# EAGLE design aaXBee (EAGLE 6.4)
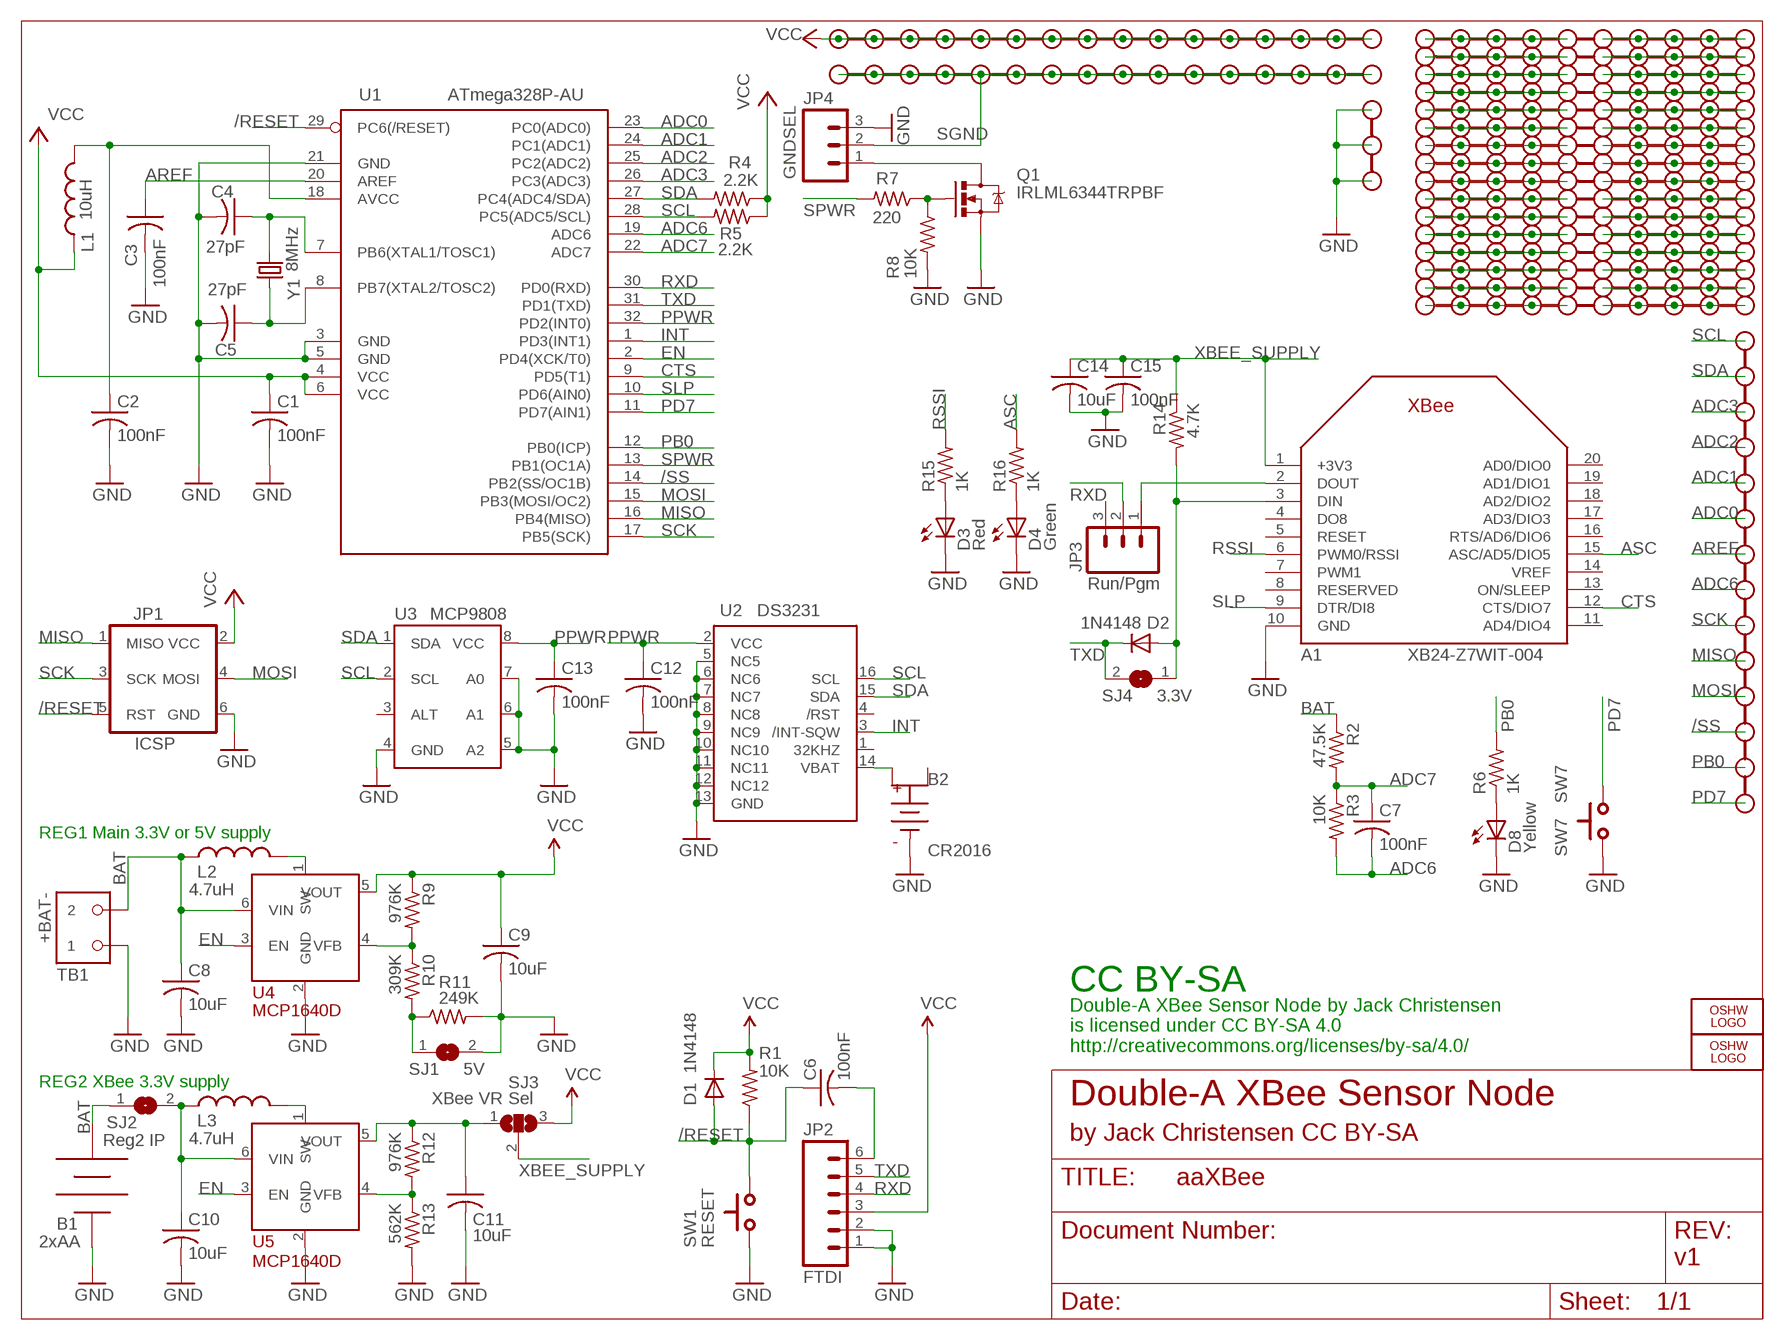
[diagram p0: schematic, sheet 1]

## Parts
A1  XB24-Z7WIT-004  ULINK_XBEEOVALPADS  [XBEE_OVAL_PADS]
B1  2xAA  BATTERY-2AANOHOLES  [KEYSTONE-2462-NO-HOLES]
B2  CR2016  COIN-CELL-2016-SMT  [BAT-HLD-002-SMT]
C1  100nF  C-USM0805  [M0805]
C2  100nF  C-USM0805  [M0805]
C3  100nF  C-USM0805  [M0805]
C4  27pF  C-USM0805  [M0805]
C5  27pF  C-USM0805  [M0805]
C6  100nF  C-USM0805  [M0805]
C7  100nF  C-USM0805  [M0805]
C8  10uF  C-USM0805  [M0805]
C9  10uF  C-USM0805  [M0805]
C10  10uF  C-USM0805  [M0805]
C11  10uF  C-USM0805  [M0805]
C12  100nF  C-USM0805  [M0805]
C13  100nF  C-USM0805  [M0805]
C14  10uF  C-USM0805  [M0805]
C15  100nF  C-USM0805  [M0805]
D1  1N4148  DIODESOD-323F-A  [SOD-323F-A]
D2  1N4148  DIODESOD-323F-A  [SOD-323F-A]
D3  Red  LEDD0805A  [D0805A]
D4  Green  LEDD0805  [D0805]
D8  Yellow  LEDD0805A  [D0805A]
JP1  ICSP  AVR_SPI_PRG_62X3_LOCK  [2X3_LOCK]
JP2  FTDI  M06LOCK  [1X06_LOCK]
JP3  Run/Pgm  M03LOCK  [1X03_LOCK]
JP4  GNDSEL  M03LOCK  [1X03_LOCK]
L1  10uH  INDUCTORM0805  [M0805]
L2  4.7uH  INDUCTORNRS4018  [NRS4018]
L3  4.7uH  INDUCTORNRS4018  [NRS4018]
LOGO1  OSHW_LOGO_8MILX0150-NT  [OSHW_8X150_NOTEXT]
LOGO2  OSHW_LOGO_8MILX0150-NT  [OSHW_8X150_NOTEXT]
PR1  PROTO-10  [PROTO-10]
PR2  PROTO-10  [PROTO-10]
PR3  PROTO-10  [PROTO-10]
PR4  PROTO-10  [PROTO-10]
PR5  PROTO-10  [PROTO-10]
PR6  PROTO-10  [PROTO-10]
PR7  PROTO-10  [PROTO-10]
PR8  PROTO-10  [PROTO-10]
PR9  PROTO-10  [PROTO-10]
PR10  PROTO-10  [PROTO-10]
PR11  PROTO-10  [PROTO-10]
PR12  PROTO-10  [PROTO-10]
PR13  GND  PROTO-3  [PROTO-3]
PR14  PROTO-10  [PROTO-10]
PR15  PROTO-10  [PROTO-10]
PR16  PROTO-10  [PROTO-10]
PR17  PROTO-10  [PROTO-10]
PR18  Proto ground  PROTO-16  [PROTO-16]
PR19  Proto Vcc  PROTO-16  [PROTO-16]
PR20  Signals  PROTO-14NR  [PROTO-14-NR]
Q1  IRLML6344TRPBF  MOSFET-NCHANNELSOT23  [SOT23]
R1  10K  R-US_M0805  [M0805]
R2  47.5K  R-US_M0805  [M0805]
R3  10K  R-US_M0805  [M0805]
R4  2.2K  R-US_M0805  [M0805]
R5  2.2K  R-US_M0805  [M0805]
R6  1K  R-US_M0805  [M0805]
R7  220  R-US_M0805  [M0805]
R8  10K  R-US_M0805  [M0805]
R9  976K  R-US_M0805  [M0805]
R10  309K  R-US_M0805  [M0805]
R11  249K  R-US_M0805  [M0805]
R12  976K  R-US_M0805  [M0805]
R13  562K  R-US_M0805  [M0805]
R14  4.7K  R-US_M0805  [M0805]
R15  1K  R-US_M0805  [M0805]
R16  1K  R-US_M0805  [M0805]
SJ1  5V  SJ  [SJ]
SJ2  Reg2 IP  SJ  [SJ]
SJ3  XBee VR Sel  SJ2W  [SJ_2]
SJ4  3.3V  SJ  [SJ]
SW1  RESET  SPST-NO-MCTACT-6X3.5-SMT  [SWITCH-TACT-6X3.5-SMT]
SW7  SW7  SPST-NO-MCTACT-6X3.5-SMT  [SWITCH-TACT-6X3.5-SMT]
TB1  +BAT-  OST-TB-23.5MM  [OST-TB-2-3.5MM]
U1  ATmega328P-AU  MEGA8-AI  [TQFP32-08]
U2  DS3231  [SO-16DW]
U3  MCP9808  [MSOP8]
U4  MCP1640D  MCP1640  [SOT23-6]
U5  MCP1640D  MCP1640  [SOT23-6]
Y1  8MHz  CRYSTALABM2  [CRYSTAL-ABRACON-ABM2]

## Nets
/RESET: C6.1 D1.A JP1.5(RST) R1.1 SW1.P$1 U1.29(PC6(/RESET))
/SS: PR20.3 U1.14(PB2(SS/OC1B))
ADC0: PR20.9 U1.23(PC0(ADC0))
ADC1: PR20.10 U1.24(PC1(ADC1))
ADC2: PR20.11 U1.25(PC2(ADC2))
ADC3: PR20.12 U1.26(PC3(ADC3))
ADC6: C7.2 PR20.7 R3.2 U1.19(ADC6)
ADC7: C7.1 R2.2 R3.1 U1.22(ADC7)
AREF: C3.1 PR20.8 U1.20(AREF)
ASC: A1.15(ASC/AD5/DIO5) R16.2
BAT: B1.POS C8.1 L2.P$1 R2.1 SJ2.1 TB1.P$2 U4.6(VIN)
CTS: A1.12(CTS/DIO7) U1.9(PD5(T1))
EN: U1.2(PD4(XCK/T0)) U4.3(EN) U5.3(EN)
GND: A1.10(GND) B1.NEG B2.NEG(B-) C1.2 C2.2 C3.2 C4.2 C5.2 C8.2 C9.2 C10.2 C11.2 C12.2 C13.2 C14.2 C15.2 D3.K(C) D4.K(C) D8.K(C) JP1.6(GND) JP2.1 JP2.2 JP4.3 PR13.1 PR13.2 PR13.3 Q1.2(S) R8.2 R11.2 R13.2 SJ1.2 SW1.P$2 SW7.P$2 TB1.P$1 U1.3(GND) U1.5(GND) U1.21(GND) U2.5(NC5) U2.6(NC6) U2.7(NC7) U2.8(NC8) U2.9(NC9) U2.10(NC10) U2.11(NC11) U2.12(NC12) U2.13(GND) U3.4(GND) U3.5(A2) U3.6(A1) U3.7(A0) U4.2(GND) U5.2(GND)
INT: U1.1(PD3(INT1)) U2.3(/INT-SQW)
MISO: JP1.1(MISO) PR20.5 U1.16(PB4(MISO))
MOSI: JP1.4(MOSI) PR20.4 U1.15(PB3(MOSI/OC2))
N$1: B2.POS1 U2.14(VBAT)
N$2: D8.A R6.1
N$4: PR1.6 PR1.7 PR1.8 PR1.9 PR1.10
N$5: PR5.6 PR5.7 PR5.8 PR5.9 PR5.10
N$6: R9.2 R10.1 U4.4(VFB)
N$7: L2.P$2 U4.1(SW)
N$8: R10.2 R11.1 SJ1.1
N$9: PR2.6 PR2.7 PR2.8 PR2.9 PR2.10
N$10: PR3.6 PR3.7 PR3.8 PR3.9 PR3.10
N$12: R12.2 R13.1 U5.4(VFB)
N$13: L3.P$2 U5.1(SW)
N$14: PR4.6 PR4.7 PR4.8 PR4.9 PR4.10
N$15: PR6.6 PR6.7 PR6.8 PR6.9 PR6.10
N$16: PR7.1 PR7.2 PR7.3 PR7.4 PR7.5
N$17: PR8.1 PR8.2 PR8.3 PR8.4 PR8.5
N$18: PR9.1 PR9.2 PR9.3 PR9.4 PR9.5
N$19: PR10.1 PR10.2 PR10.3 PR10.4 PR10.5
N$20: PR11.1 PR11.2 PR11.3 PR11.4 PR11.5
N$21: PR12.1 PR12.2 PR12.3 PR12.4 PR12.5
N$22: PR1.1 PR1.2 PR1.3 PR1.4 PR1.5
N$23: PR2.1 PR2.2 PR2.3 PR2.4 PR2.5
N$24: Q1.1(G) R7.1 R8.1
N$25: PR3.1 PR3.2 PR3.3 PR3.4 PR3.5
N$26: PR4.1 PR4.2 PR4.3 PR4.4 PR4.5
N$27: PR6.1 PR6.2 PR6.3 PR6.4 PR6.5
N$28: PR7.6 PR7.7 PR7.8 PR7.9 PR7.10
N$29: PR5.1 PR5.2 PR5.3 PR5.4 PR5.5
N$30: PR8.6 PR8.7 PR8.8 PR8.9 PR8.10
N$31: PR9.6 PR9.7 PR9.8 PR9.9 PR9.10
N$32: PR10.6 PR10.7 PR10.8 PR10.9 PR10.10
N$33: PR11.6 PR11.7 PR11.8 PR11.9 PR11.10
N$34: PR12.6 PR12.7 PR12.8 PR12.9 PR12.10
N$35: C10.1 L3.P$1 SJ2.2 U5.6(VIN)
N$36: JP4.1 Q1.3(D)
N$37: A1.3(DIN) D2.A R14.2 SJ4.1
N$38: A1.2(DOUT) JP3.1
N$39: C11.1 R12.1 SJ3.1 U5.5(VOUT)
N$40: PR14.1 PR14.2 PR14.3 PR14.4 PR14.5
N$41: D3.A R15.1
N$42: D4.A R16.1
N$43: C4.1 U1.7(PB6(XTAL1/TOSC1)) Y1.P$2
N$44: C5.1 U1.8(PB7(XTAL2/TOSC2)) Y1.P$1
N$45: PR14.6 PR14.7 PR14.8 PR14.9 PR14.10
N$46: C2.1 L1.2 U1.18(AVCC)
N$47: PR15.1 PR15.2 PR15.3 PR15.4 PR15.5
N$48: PR15.6 PR15.7 PR15.8 PR15.9 PR15.10
N$49: PR16.1 PR16.2 PR16.3 PR16.4 PR16.5
N$50: PR16.6 PR16.7 PR16.8 PR16.9 PR16.10
N$51: PR17.1 PR17.2 PR17.3 PR17.4 PR17.5
N$52: PR17.6 PR17.7 PR17.8 PR17.9 PR17.10
PB0: PR20.2 R6.2 U1.12(PB0(ICP))
PD7: PR20.1 SW7.P$1 U1.11(PD7(AIN1))
PPWR: C12.1 C13.1 U1.32(PD2(INT0)) U2.2(VCC) U3.8(VCC)
RSSI: A1.6(PWM0/RSSI) R15.2
RST: C6.2 JP2.6
RXD: JP2.4 JP3.2 U1.30(PD0(RXD))
SCK: JP1.3(SCK) PR20.6 U1.17(PB5(SCK))
SCL: PR20.14 R5.2 U1.28(PC5(ADC5/SCL)) U2.16(SCL) U3.2(SCL)
SDA: PR20.13 R4.2 U1.27(PC4(ADC4/SDA)) U2.15(SDA) U3.1(SDA)
SGND: JP4.2 PR18.1 PR18.2 PR18.3 PR18.4 PR18.5 PR18.6 PR18.7 PR18.8 PR18.9 PR18.10 PR18.11 PR18.12 PR18.13 PR18.14 PR18.15 PR18.16
SLP: A1.9(DTR/DI8) U1.10(PD6(AIN0))
SPWR: R7.2 U1.13(PB1(OC1A))
TXD: D2.K JP2.5 SJ4.2 U1.31(PD1(TXD))
VCC: C1.1 C9.1 D1.K JP1.2(VCC) JP2.3 L1.1 PR19.1 PR19.2 PR19.3 PR19.4 PR19.5 PR19.6 PR19.7 PR19.8 PR19.9 PR19.10 PR19.11 PR19.12 PR19.13 PR19.14 PR19.15 PR19.16 R1.2 R4.1 R5.1 R9.1 SJ3.3 U1.4(VCC) U1.6(VCC) U4.5(VOUT)
XBEE_SUPPLY: A1.1(+3V3) C14.1 C15.1 R14.1 SJ3.2
Unconnected: A1.4(DO8) A1.5(RESET) A1.7(PWM1) A1.8(RESERVED) A1.11(AD4/DIO4) A1.13(ON/SLEEP) A1.14(VREF) A1.16(RTS/AD6/DIO6) A1.17(AD3/DIO3) A1.18(AD2/DIO2) A1.19(AD1/DIO1) A1.20(AD0/DIO0) B2.POS2 JP3.3 U2.1(32KHZ) U2.4(/RST) U3.3(ALT)

## Notes on the sheet
- REG1 Main 3.3V or 5V supply
- CC BY-SA
- Double-A XBee Sensor Node by Jack Christensen
  is licensed under CC BY-SA 4.0
  http://creativecommons.org/licenses/by-sa/4.0/
- REG2 XBee 3.3V supply
- Double-A XBee Sensor Node
- by Jack Christensen CC BY-SA
- v1

## Library data of the parts
A1 = _jc:ULINK_XBEE
B1 = _jc:BATTERY-2AA
B2 = _jc:COIN-CELL
C1-C15 = _jc:C-US: CAPACITOR, American symbol
D1 D2 = _jc:DIODE
D3 D4 D8 = _jc:LED: LED OSRAM: - CHIPLED LG R971, LG N971, LY N971, LG Q971, LY Q971, LO R971, LY R971 LH N974, LH R974 LS Q976, LO Q976, LY Q976 LO Q996 - Hyper CHIPLED LW Q18S LB Q993, LB Q99A, LB R99A - SideLED LS A670, LO A670, LY A670, LG A670, LP A670 LB A673, LV A673, LT A673, LW A673 LH A674 LY A675 LS A676, LA A676, LO A676, LY A676, LW A676 LS A679, LY A679, LG A679 - Hyper Micro SIDELED® LS Y876, LA Y876, LO Y876, LY Y876 LT Y87S - SmartLED LW L88C, LW L88S LB L89C, LB L89S, LG L890 LS L89K, LO L89K, LY L89K LS L896, LA L896, LO L896, LY L896 - TOPLED LS T670, LO T670, LY T670, LG T670, LP T670 LSG T670, LSP T670, LSY T670, LOP T670, LYG T670 LG T671, LOG T671, LSG T671 LB T673, LV T673, LT T673, LW T673 LH T674 LS T676, LA T676, LO T676, LY T676, LB T676, LH T676, LSB T676, LW T676 LB T67C, LV T67C, LT T67C, LS T67K, LO T67K, LY T67K, LW E67C LS E67B, LA E67B, LO E67B, LY E67B, LB E67C, LV E67C, LT E67C LW T67C LS T679, LY T679, LG T679 LS T770, LO T770, LY T770, LG T770, LP T770 LB T773, LV T773, LT T773, LW T773 LH T774 LS E675, LA E675, LY E675, LS T675 LS T776, LA T776, LO T776, LY T776, LB T776 LHGB T686 LT T68C, LB T68C - Hyper Mini TOPLED® LB M676 - Mini TOPLED Santana® LG M470 LS M47K, LO M47K, LY M47K Source: http://www.osram.convergy.de/
JP1 = _jc:AVR_SPI_PRG_6: AVR ISP 6 Pin This is the reduced ISP connector for AVR programming. Common on Arduino. This footprint will take up less PCB space and can be used with a 10-pin to 6-pin adapter such as SKU: BOB-08508
JP2 = SparkFun:M06: Header 6 Standard 6-pin 0.1" header. Use with straight break away headers (SKU : PRT-00116), right angle break away headers (PRT-00553), swiss pins (PRT-00743), machine pins (PRT-00117), and female headers (PRT-00115). Molex polarized connector foot print use with SKU : PRT-08094 with associated crimp pins and housings. NOTES ON THE VARIANTS LOCK and LOCK_LONGPADS... This footprint was designed to help hold the alignment of a through-hole component (i.e. 6-pin header) while soldering it into place. You may notice that each hole has been shifted either up or down by 0.005 of an inch from it's more standard position (which is a perfectly straight line). This slight alteration caused the pins (the squares in the middle) to touch the edges of the holes. Because they are alternating, it causes a "brace" to hold the component in place. 0.005 has proven to be the perfect amount of "off-center" position when using our standard breakaway headers. Although looks a little odd when you look at the bare footprint, once you have a header in there, the alteration is very hard to notice. Also, if you push a header all the way into place, it is covered up entirely on the bottom side. This idea of altering the position of holes to aid alignment will be further integrated into the Sparkfun Library for other footprints. It can help hold any component with 3 or more connection pins.
JP3 JP4 = SparkFun:M03: Header 3 Standard 3-pin 0.1" header. Use with straight break away headers (SKU : PRT-00116), right angle break away headers (PRT-00553), swiss pins (PRT-00743), machine pins (PRT-00117), and female headers (PRT-00115). Molex polarized connector foot print use with SKU : PRT-08232 with associated crimp pins and housings.
L1-L3 = _jc:INDUCTOR: Murata #11R472C
LOGO1 LOGO2 = ohw-logo:OSHW_LOGO_8MIL
PR1-PR12 PR14-PR17 = _jc:PROTO-10
PR13 = _jc:PROTO-3
PR18 PR19 = _jc:PROTO-16
PR20 = _jc:PROTO-14
Q1 = _jc:MOSFET-NCHANNEL
R1-R16 = _jc:R-US_: RESISTOR, American symbol
SJ1 SJ2 SJ4 = jumper:SJ: SMD solder JUMPER
SJ3 = jumper:SJ2W: SMD solder JUMPER
SW1 SW7 = _jc:SPST-NO-MC
TB1 = _jc:OST-TB-2
U1 = atmel:MEGA8: MICROCONTROLLER 8 Kbytes FLASH, 1 kbytes SRAM, 512 bytes EEPROM, USART, 6-channel 10 bit ADC, 2-channel 8 bit ADC Pin compatible with Atmega48, ATMega88, ATMega168 Source: avr.lbr; MPN: ATMEGA8-16AU; OC_FARNELL: 9171371; OC_NEWARK: 73M8863
U2 = _jc:DS3231
U3 = _jc:MCP9808
U4 U5 = _jc:MCP1640
Y1 = _jc:CRYSTAL

## Board
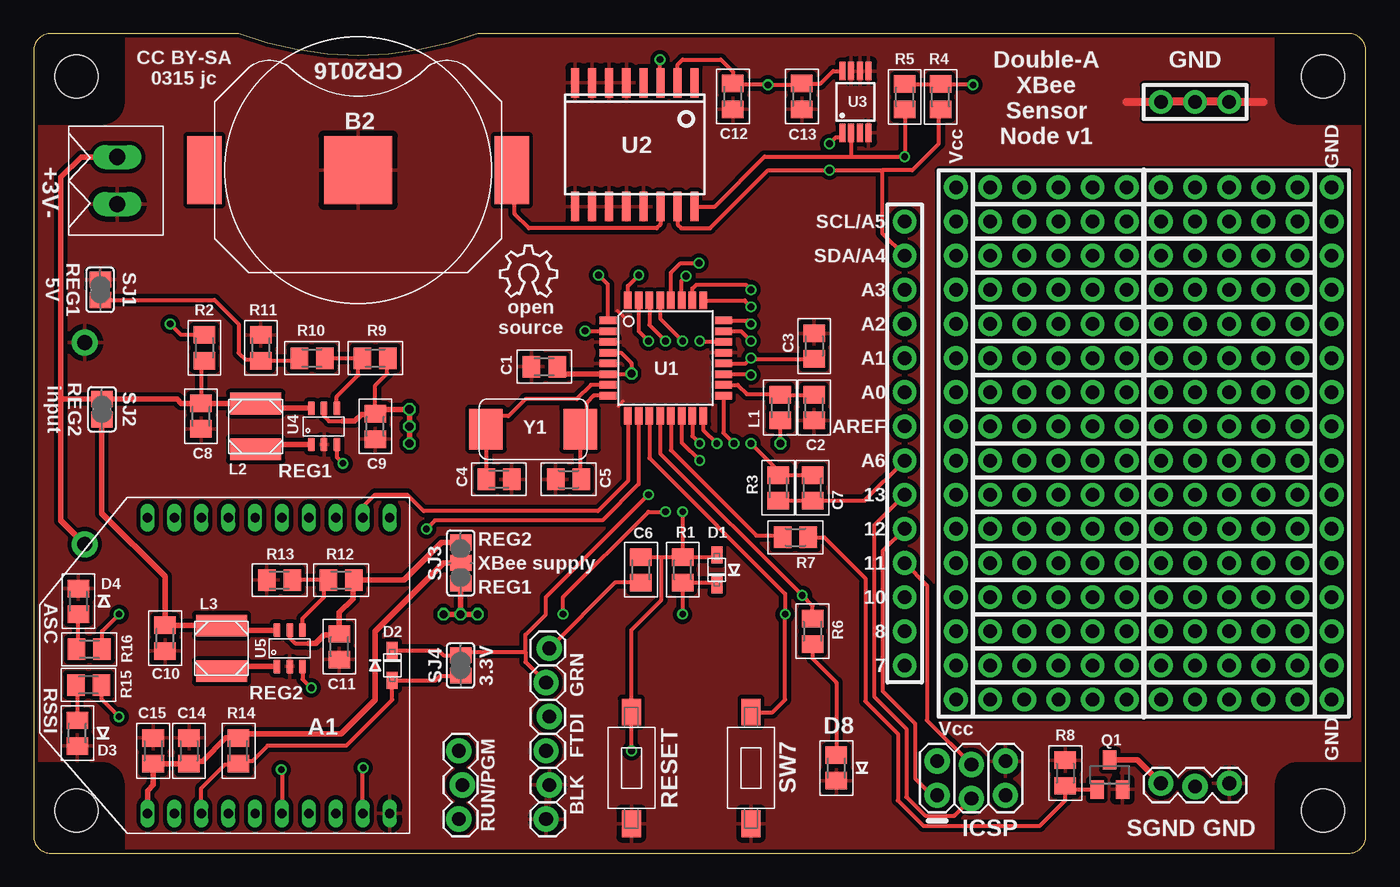
[diagram p1: board, top side]
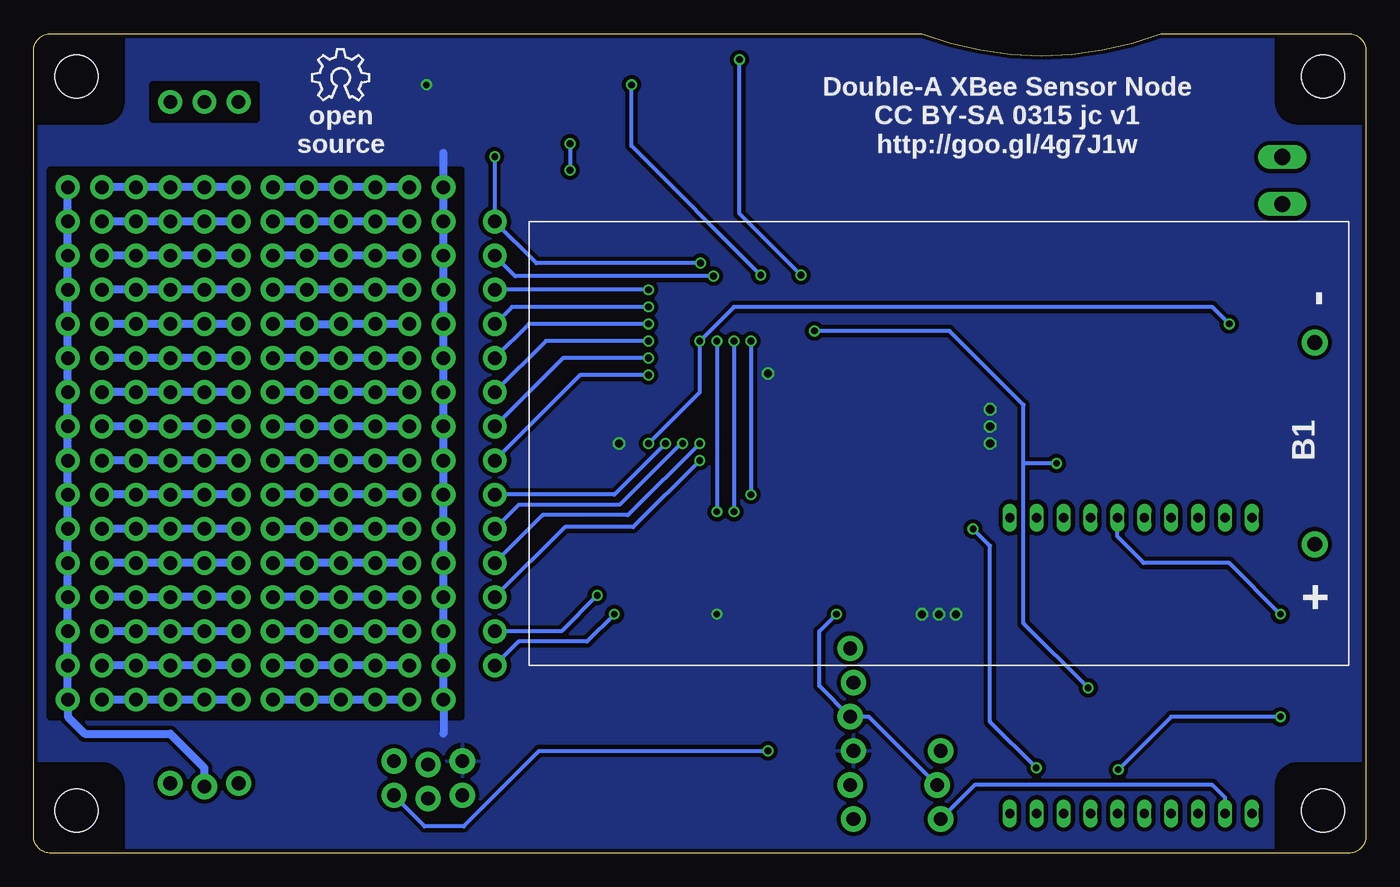
[diagram p2: board, bottom side, seen from below]

Size 99.06 x 60.96 mm. Coordinates in mm from the lower left corner, seen from the top.
Outline: 0,59.69 0,1.27 arc90 1.27,0 97.79,0 arc90 99.06,1.27 99.06,59.69 arc90 97.79,60.96 33.02,60.96 arc-41 15.24,60.96 1.27,60.96 arc90 0,59.69
Copper layers (1*16): Top 0.035mm / dielectric 1.5mm / Bottom 0.035mm
Design rules "SeeedStudio_DRU_jc_20140311 *": minimum track width 6mil, minimum drill 12mil, track to track 6mil, track to pad 6mil, pad to pad 6mil, via to via 6mil, smd to smd 0mil, copper to edge 10mil, drill to drill 10mil, minimum pad ring 6mil, minimum via ring 6mil, stop-mask expansion 2mil, vias tented up to drill 20mil, thermal gap 16mil
Holes 3.2 mm at 3.17,3.17 95.89,3.17 95.89,57.78 3.17,57.78
tRestrict: area 92.7,54.6 to 99.1,61; area 92.7,0 to 99.1,6.3; area 0,54.6 to 6.3,61; area 0,0 to 6.3,6.3
bRestrict: area 92.7,54.6 to 99.1,61; area 92.7,0 to 99.1,6.3; area 0,54.6 to 6.3,61; area 0,0 to 6.3,6.3

### Footprints (pad centres in the part's own frame; a part is rotated, then mirrored left to right if it is on the bottom)
XBEE_OVAL_PADS = drill 0.7 pad 1 long: 1 -11,5.5; 2 -11,3.5; 3 -11,1.5; 4 -11,-0.5; 5 -11,-2.5; 6 -11,-4.5; 7 -11,-6.5; 8 -11,-8.5; 9 -11,-10.5; 10 -11,-12.5; 11 11,-12.5; 12 11,-10.5; 13 11,-8.5; 14 11,-6.5; 15 11,-4.5; 16 11,-2.5; 17 11,-0.5; 18 11,1.5; 19 11,3.5; 20 11,5.5
KEYSTONE-2462-NO-HOLES = drill 1.1 pad 1.93: NEG -27.94,-7.493; POS -27.94,7.493
BAT-HLD-002-SMT = smd 5.08 x 5.08: NEG 0,0 | smd 2.54 x 5.08: POS1 -11.43,0; POS2 11.43,0
M0805 = smd 1.3 x 1.6: 1 -0.95,0; 2 0.95,0
SOD-323F-A = smd 1.27 x 0.813: A -1.118,0; K 1.118,0
D0805A = smd 1.3 x 1.6: A -0.95,0; K 0.95,0
D0805 = smd 1.3 x 1.6: A -0.95,0; K 0.95,0
2X3_LOCK = drill 1.016 pad 1.88: 1 0,0; 2 0,2.54; 3 2.54,-0.254; 4 2.54,2.286; 5 5.08,0; 6 5.08,2.54
1X06_LOCK = drill 1.016 pad 1.88: 1 0,0; 2 2.54,-0.254; 3 5.08,0; 4 7.62,-0.254; 5 10.16,0; 6 12.7,-0.254
1X03_LOCK = drill 1.016 pad 1.88: 1 0,0.127; 2 2.54,-0.127; 3 5.08,0.127
NRS4018 = smd 1.6 x 3.8: P$1 -1.7,0; P$2 1.7,0
PROTO-10 = drill 1 pad 1.778: 1 -11.43,0; 2 -8.89,0; 3 -6.35,0; 4 -3.81,0; 5 -1.27,0; 6 1.27,0; 7 3.81,0; 8 6.35,0; 9 8.89,0; 10 11.43,0
PROTO-3 = drill 1 pad 1.778: 1 -2.54,0; 2 0,0; 3 2.54,0
PROTO-16 = drill 1 pad 1.778: 1 -19.05,0; 2 -16.51,0; 3 -13.97,0; 4 -11.43,0; 5 -8.89,0; 6 -6.35,0; 7 -3.81,0; 8 -1.27,0; 9 1.27,0; 10 3.81,0; 11 6.35,0; 12 8.89,0; 13 11.43,0; 14 13.97,0; 15 16.51,0; 16 19.05,0
PROTO-14-NR = drill 1 pad 1.778: 1 -16.51,0; 2 -13.97,0; 3 -11.43,0; 4 -8.89,0; 5 -6.35,0; 6 -3.81,0; 7 -1.27,0; 8 1.27,0; 9 3.81,0; 10 6.35,0; 11 8.89,0; 12 11.43,0; 13 13.97,0; 14 16.51,0
SOT23 = smd 1 x 1.4: 1 -0.95,-1.1; 2 0.95,-1.1; 3 0,1.1
SJ = smd 1.168 x 1.6: 1 -0.762,0; 2 0.762,0
SJ_2 = smd 1.168 x 1.6: 1 -1.524,0; 2 0,0; 3 1.524,0
SWITCH-TACT-6X3.5-SMT = smd 2 x 1.4: P$1 -4.15,0; P$2 4.15,0
OST-TB-2-3.5MM = drill 1.2 long: P$1 1.75,0; P$2 -1.75,0
TQFP32-08 = smd 1.27 x 0.559: 1 -4.293,2.8; 2 -4.293,2; 3 -4.293,1.2; 4 -4.293,0.4; 5 -4.293,-0.4; 6 -4.293,-1.2; 7 -4.293,-2; 8 -4.293,-2.8; 17 4.293,-2.8; 18 4.293,-2; 19 4.293,-1.2; 20 4.293,-0.4; 21 4.293,0.4; 22 4.293,1.2; 23 4.293,2; 24 4.293,2.8 | smd 0.559 x 1.27: 9 -2.8,-4.293; 10 -2,-4.293; 11 -1.2,-4.293; 12 -0.4,-4.293; 13 0.4,-4.293; 14 1.2,-4.293; 15 2,-4.293; 16 2.8,-4.293; 25 2.8,4.293; 26 2,4.293; 27 1.2,4.293; 28 0.4,4.293; 29 -0.4,4.293; 30 -1.2,4.293; 31 -2,4.293; 32 -2.8,4.293
SO-16DW = smd 0.6 x 2.2: 1 -4.445,-4.6; 2 -3.175,-4.6; 3 -1.905,-4.6; 4 -0.635,-4.6; 5 0.635,-4.6; 6 1.905,-4.6; 7 3.175,-4.6; 8 4.445,-4.6; 9 4.445,4.6; 10 3.175,4.6; 11 1.905,4.6; 12 0.635,4.6; 13 -0.635,4.6; 14 -1.905,4.6; 15 -3.175,4.6; 16 -4.445,4.6
MSOP8 = smd 0.45 x 1.35: 1 -0.975,-2.3; 2 -0.325,-2.3; 3 0.325,-2.3; 4 0.975,-2.3; 5 0.975,2.3; 6 0.325,2.3; 7 -0.325,2.3; 8 -0.975,2.3
SOT23-6 = smd 0.508 x 1.016: 1 -0.95,-1.35; 2 0,-1.35; 3 0.95,-1.35; 4 0.95,1.35; 5 0,1.35; 6 -0.95,1.35
CRYSTAL-ABRACON-ABM2 = smd 2.5 x 3: P$1 -3.5,0; P$2 3.5,0

### Placement (x,y rotation side)
A1  13.97,13.97 90 top
B1  31.75,30.48 180 bottom
B2  24.13,50.8 180 top
C1  37.97,36.2 180 top
C2  58.04,33.15 270 top
C3  58.04,37.72 90 top
C4  34.59,27.81 0 top
C5  39.78,27.81 180 top
C6  45.16,21.08 270 top
C7  57.91,27.18 270 top
C8  12.45,32.51 270 top
C9  25.4,31.75 270 top
C10  9.78,16 270 top
C11  22.73,15.37 270 top
C12  51.99,56.29 270 top
C13  57.12,56.29 270 top
C14  11.56,7.62 90 top
C15  8.89,7.62 90 top
D1  50.8,21.08 270 top
D2  26.67,13.97 90 top
D3  3.25,8.94 270 top
D4  3.33,18.75 90 top
D8  59.69,6.35 270 top
JP1  67.18,4.32 0 top
JP2  38.1,2.54 90 top
JP3  31.75,2.54 90 top
JP4  83.82,5.08 0 top
L1  55.5,33.15 90 top
L2  16.51,31.75 270 top
L3  13.97,15.24 270 top
LOGO1  34.67,41.4 0 top
LOGO2  78.36,56.01 0 bottom
PR1  82.55,19.05 0 top
PR2  82.55,21.59 0 top
PR3  82.55,24.13 0 top
PR4  82.55,36.83 0 top
PR5  82.55,26.67 0 top
PR6  82.55,39.37 0 top
PR7  82.55,29.21 0 top
PR8  82.55,41.91 0 top
PR9  82.55,31.75 0 top
PR10  82.55,44.45 0 top
PR11  82.55,34.29 0 top
PR12  82.55,46.99 0 top
PR13  86.36,55.88 0 top
PR14  82.55,16.51 0 top
PR15  82.55,13.97 0 top
PR16  82.55,11.43 0 top
PR17  82.55,49.53 0 top
PR18  96.52,30.48 270 top
PR19  68.58,30.48 270 top
PR20  64.77,30.48 90 top
Q1  80.01,5.84 0 top
R1  48.26,21.08 270 top
R2  12.7,37.59 90 top
R3  55.37,27.18 270 top
R4  67.44,56.26 270 top
R5  64.77,56.26 270 top
R6  57.91,16.51 90 top
R7  56.64,23.5 180 top
R8  76.71,5.97 90 top
R9  25.4,36.83 180 top
R10  20.7,36.83 180 top
R11  16.89,37.59 90 top
R12  22.86,20.32 180 top
R13  18.29,20.32 180 top
R14  15.24,7.62 270 top
R15  4.09,12.52 0 top
R16  4.14,15.17 0 top
SJ1  4.95,41.91 90 top
SJ2  5.08,33.02 270 top
SJ3  31.75,21.59 270 top
SJ4  31.75,13.97 90 top
SW1  44.45,6.35 270 top
SW7  53.34,6.35 270 top
TB1  6.22,50.04 270 top
U1  46.99,36.83 0 top
U2  44.7,52.7 180 top
U3  61.11,55.88 0 top
U4  21.59,31.75 0 top
U5  19.05,15.24 0 top
Y1  37.13,31.55 180 top

### Tracks (layer width: path | path; a pad name or v marks a point on that pad's centre or on a via)
/RESET  (via drill 0.5)
  Top 0.305: U1.29 46.59,39.77 v48.26,38.1 | v44.45,7.62 SW1.P$1 44.45,16.61 46.69,18.85 46.69,21.93 46.79,22.03 | C6.1 46.79,22.03 | 46.79,22.03 R1.1 | R1.1 50.63,22.03 D1.A | v48.26,25.4 R1.1
  Bottom 0.305: v48.26,38.1 v48.26,25.4 | v44.45,7.62 61.47,7.62 67.09,2 70,2 72.26,4.26 JP1.5
/SS  (via drill 0.5)
  Top 0.305: U1.14 48.19,30.55 v49.53,29.21
  Bottom 0.305: v49.53,29.21 54.48,24.26 59.56,24.26 PR20.3
ADC0  (via drill 0.5)
  Top 0.305: U1.23 52.61,38.83 v53.34,38.1
  Bottom 0.305: v53.34,38.1 60.96,38.1 PR20.9
ADC1  (via drill 0.5)
  Top 0.305: U1.24 53.08,39.63 v53.34,39.37
  Bottom 0.305: v53.34,39.37 62.23,39.37 PR20.10
ADC2  (via drill 0.5)
  Top 0.305: U1.25 52.86,41.12 v53.34,40.64
  Bottom 0.305: v53.34,40.64 63.5,40.64 PR20.11
ADC3  (via drill 0.5)
  Top 0.305: U1.26 48.99,42.01 49.28,42.29 52.96,42.29 v53.34,41.91
  Bottom 0.305: v53.34,41.91 PR20.12
ADC6  (via drill 0.5)
  Top 0.305: U1.19 53.34,35.63 v53.34,35.56 | R3.2 C7.2 61.79,26.23 PR20.7
  Bottom 0.305: 64.26,29.21 PR20.7 58.42,35.56 v53.34,35.56
ADC7  (via drill 0.5)
  Top 0.305: U1.22 49.6,38.03 v49.53,38.1 | C7.1 R3.1 55.37,28.45 v53.34,30.48 | R2.2 10.99,38.54 v10.16,39.37
  Bottom 0.305: v53.34,30.48 49.53,34.29 v49.53,38.1 46.99,40.64 11.43,40.64 v10.16,39.37
AREF  (via drill 0.5)
  Top 0.305: U1.20 52.94,36.43 v53.34,36.83 53.4,36.77 C3.1
  Bottom 0.305: v53.34,36.83 59.69,36.83 PR20.8
ASC  (via drill 0.5)
  Top 0.305: R16.2 5.09,16.52 v6.35,17.78
  Bottom 0.305: v6.35,17.78 10.16,21.59 16.51,21.59 18.47,23.55 A1.15
BAT
  Top 0.305: R2.1 12.45,36.39 C8.1
  Top 0.406: 12.51,33.02 C8.1 | U4.6 16.86,33.1 L2.P$1 16.5,33.46 C8.1 | C8.1 10.99,33.46 10.67,33.78 SJ2.1 2.16,33.78 2.03,33.66 | 2.03,33.66 2.03,50.29 3.53,51.79 TB1.P$2 | 2.03,33.66 2.03,24.77 B1.POS
CTS
  Top 0.305: U1.9 44.19,27.68 41.96,25.45 29.01,25.45 27.79,26.67 25.4,26.67 24.47,25.74 A1.12
EN  (via drill 0.5)
  Top 0.305: U5.3 20,12.95 v20.65,12.3 | v41,38.85 42.68,38.85 U1.2 | U4.3 22.54,29.46 v23,29
  Bottom 0.305: v20.65,12.3 25.45,17.1 25.45,29 | 25.45,29 25.45,33.35 30.95,38.85 v41,38.85 | v23,29 25.45,29
GND
  Top 0.254: 43.43,40.34 43.89,39.88 | 43.48,33.27 43.84,33.63
  Top 0.61: 91.44,55.88 PR13.3 PR13.2 PR13.1 81.28,55.88
  pour Top (isolate 0.305): -2.54,63.5 -2.54,-2.54 101.6,-2.54 101.6,63.5
INT  (via drill 0.5)
  Top 0.305: U2.3 46.58,57.33 v46.58,59.03 | U1.1 42.7,42.3 v42,43
  Bottom 0.305: v42,43 46.58,47.58 v46.58,59.03
MISO  (via drill 0.5)
  Top 0.305: U1.16 49.79,31.49 v50.8,30.48 | PR20.5 63.12,22.48 63.12,12.06 65.53,9.65 65.53,5.59 66.8,4.32 JP1.1
  Bottom 0.305: v50.8,30.48 50.93,30.48 55.5,25.91 62.99,25.91 PR20.5
MOSI  (via drill 0.5)
  Top 0.305: U1.15 48.99,31.02 v49.53,30.48 | PR20.4 66.42,19.94 66.42,9.91 JP1.4
  Bottom 0.305: v49.53,30.48 54.86,25.15 61.21,25.15 PR20.4
N$1
  Top 0.305: U2.14 46.61,46.76 46.33,46.48 36.83,46.48 35.76,47.55 35.76,50.6 B2.POS1
N$2
  Top 0.305: R6.1 57.91,14.48 59.69,12.7 D8.A
N$4
  Bottom 0.61: PR1.6 PR1.7 PR1.8 PR1.9 PR1.10
N$5
  Bottom 0.61: PR5.6 PR5.7 PR5.8 PR5.9 PR5.10
N$6
  Top 0.305: R10.1 R9.2 24.13,36.51 24.13,35.56 22.54,33.97 U4.4
N$7
  Top 0.406: U4.1 16.86,30.4 L2.P$2
N$8
  Top 0.305: SJ1.1 13.46,41.15 15.24,39.37 15.24,37.21 15.75,36.7 16.83,36.7 R11.1 19.56,36.64 R10.2
N$9
  Bottom 0.61: PR2.6 PR2.7 PR2.8 PR2.9 PR2.10
N$10
  Bottom 0.61: PR3.6 PR3.7 PR3.8 PR3.9 PR3.10
N$12
  Top 0.305: R13.1 R12.2 21.59,20 21.59,19.05 20,17.46 U5.4
N$13
  Top 0.406: U5.1 14.32,13.89 L3.P$2
N$14
  Bottom 0.61: PR4.6 PR4.7 PR4.8 PR4.9 PR4.10
N$15
  Bottom 0.61: PR6.6 PR6.7 PR6.8 PR6.9 PR6.10
N$16
  Bottom 0.61: PR7.1 PR7.2 PR7.3 PR7.4 PR7.5
N$17
  Bottom 0.61: PR8.1 PR8.2 PR8.3 PR8.4 PR8.5
N$18
  Bottom 0.61: PR9.1 PR9.2 PR9.3 PR9.4 PR9.5
N$19
  Bottom 0.61: PR10.1 PR10.2 PR10.3 PR10.4 PR10.5
N$20
  Bottom 0.61: PR11.1 PR11.2 PR11.3 PR11.4 PR11.5
N$21
  Bottom 0.61: PR12.1 PR12.2 PR12.3 PR12.4 PR12.5
N$22
  Bottom 0.61: PR1.1 PR1.2 PR1.3 PR1.4 PR1.5
N$23
  Bottom 0.61: PR2.1 PR2.2 PR2.3 PR2.4 PR2.5
N$24
  Top 0.305: 76.52,5.02 R8.1 | R8.1 76.98,4.74 Q1.1 | R7.1 58.8,23.5 61.85,20.45 61.85,11.3 64.26,8.89 64.26,3.94 66.17,2.03 74.8,2.03 76.71,3.94 R8.1
N$25
  Bottom 0.61: PR3.1 PR3.2 PR3.3 PR3.4 PR3.5
N$26
  Bottom 0.61: PR4.1 PR4.2 PR4.3 PR4.4 PR4.5
N$27
  Bottom 0.61: PR6.1 PR6.2 PR6.3 PR6.4 PR6.5
N$28
  Bottom 0.61: PR7.6 PR7.7 PR7.8 PR7.9 PR7.10
N$29
  Bottom 0.61: PR5.1 PR5.2 PR5.3 PR5.4 PR5.5
N$30
  Bottom 0.61: PR8.6 PR8.7 PR8.8 PR8.9 PR8.10
N$31
  Bottom 0.61: PR9.6 PR9.7 PR9.8 PR9.9 PR9.10
N$32
  Bottom 0.61: PR10.6 PR10.7 PR10.8 PR10.9 PR10.10
N$33
  Bottom 0.61: PR11.6 PR11.7 PR11.8 PR11.9 PR11.10
N$34
  Bottom 0.61: PR12.6 PR12.7 PR12.8 PR12.9 PR12.10
N$35
  Top 0.406: U5.6 14.32,16.59 L3.P$1 13.96,16.95 C10.1 9.78,20.57 5.08,25.27 SJ2.2
N$36
  Top 0.406: Q1.3 82.08,6.94 JP4.1
N$37
  Top 0.305: SJ4.1 30.23,13.21 29.87,12.85 D2.A 26.67,11.43 23.24,8 17.4,8 16.26,6.86 15.43,6.86 | A1.3 12.47,4.85 14.22,6.6 15.17,6.6 R14.2
  Top 0.406: 15.43,6.86 R14.2
N$38
  Bottom 0.305: A1.2 10.47,4.12 11.43,5.08 29.08,5.08 JP3.1
N$39
  Top 0.305: U5.5 19.05,16 19.43,15.62 20.45,15.62
  Top 0.406: SJ3.1 30.35,23.11 27.56,20.32 R12.1 23.75,20.26 23.75,18.92 22.73,17.91 C11.1 22.67,16.26 21.59,16.26 20.95,15.62 20.45,15.62
N$40
  Bottom 0.61: PR14.1 PR14.2 PR14.3 PR14.4 PR14.5
N$41
  Top 0.305: R15.1 3.25,12.21 D3.A
N$42
  Top 0.305: R16.1 3.33,15.5 D4.A
N$43
  Top 0.305: C4.1 33.63,27.82 Y1.P$2 34.6,32.51 35.31,32.51 36.58,33.78 40.39,33.78 41.43,34.83 U1.7
N$44
  Top 0.305: C5.1 40.63,27.91 Y1.P$1 41.1,32.01 41.1,33.48 41.65,34.03 U1.8
N$45
  Bottom 0.61: PR14.6 PR14.7 PR14.8 PR14.9 PR14.10
N$46
  Top 0.305: C2.1 L1.2 55.46,34.14 53.03,34.14 52.34,34.83 U1.18
N$47
  Bottom 0.61: PR15.1 PR15.2 PR15.3 PR15.4 PR15.5
N$48
  Bottom 0.61: PR15.6 PR15.7 PR15.8 PR15.9 PR15.10
N$49
  Bottom 0.61: PR16.1 PR16.2 PR16.3 PR16.4 PR16.5
N$50
  Bottom 0.61: PR16.6 PR16.7 PR16.8 PR16.9 PR16.10
N$51
  Bottom 0.61: PR17.1 PR17.2 PR17.3 PR17.4 PR17.5
N$52
  Bottom 0.61: PR17.6 PR17.7 PR17.8 PR17.9 PR17.10
PB0  (via drill 0.5)
  Top 0.305: U1.12 46.59,29.74 v57.15,19.18 57.91,18.41 R6.2
  Bottom 0.305: v57.15,19.18 59.82,16.51 PR20.2
PD7  (via drill 0.5)
  Top 0.305: U1.11 45.79,29.39 55.88,19.3 v55.88,17.78 55.88,11.43 54.95,10.5 SW7.P$1
  Bottom 0.305: v55.88,17.78 57.91,15.75 62.99,15.75 PR20.1
PPWR  (via drill 0.5)
  Top 0.305: U2.2 47.88,58.65 48.26,59.03 51.1,59.03 52.02,58.12 52.02,57.29 C12.1 52.11,57.15 v54.61,57.15 57.04,57.15 C13.1 58.51,57.24 59.44,58.17 60.12,58.17 U3.8 | U1.32 44.19,42.19 v45,43
  Bottom 0.305: v45,43 54.61,52.61 v54.61,57.15
RSSI  (via drill 0.5)
  Top 0.305: R15.2 5.04,11.47 v6.35,10.16 | v18.41,6.22 18.47,6.17 A1.6
  Bottom 0.305: v6.35,10.16 14.48,10.16 v18.41,6.22
RST
  Top 0.305: C6.2 43.25,20.13 JP2.6
RXD  (via drill 0.5)
  Top 0.305: U1.30 45.79,39.3 v46.99,38.1 | v39.37,17.78 39.37,19.05 45.72,25.4 v46.99,25.4
  Bottom 0.305: JP3.2 36.96,10.16 JP2.4 40.64,12.45 40.64,16.51 v39.37,17.78 | v46.99,38.1 v46.99,25.4
SCK  (via drill 0.5)
  Top 0.305: U1.17 51.28,31.27 v52.07,30.48 | PR20.6 62.48,24.38 62.48,11.68 64.9,9.27 64.9,4.19 66.29,2.79 68.45,2.79 JP1.3
  Bottom 0.305: v52.07,30.48 55.88,26.67 PR20.6
SCL  (via drill 0.5)
  Top 0.305: U1.28 47.39,43.17 48.11,43.89 v49.48,43.89 | U2.16 50.65,48.1 54.36,51.82 60.83,51.82 | R5.2 v64.77,51.82 60.83,51.82 | U3.2 60.79,51.86 60.83,51.82
  Bottom 0.305: v49.48,43.89 61.67,43.89 PR20.14 v64.77,51.82
SDA  (via drill 0.5)
  Top 0.305: U1.27 48.19,42.6 v48.51,42.93 | U2.15 47.88,46.76 48.16,46.48 50.29,46.48 54.61,50.8 v59.18,50.8 59.69,50.8 63.09,50.8 | R4.2 67.31,55.18 67.31,52.78 65.33,50.8 63.09,50.8 | 63.09,50.8 63.09,46.13 PR20.13 | U3.1 60.14,53.23 59.63,53.23 v59.18,52.78
  Bottom 0.305: v48.51,42.93 63.25,42.93 PR20.13 | v59.18,52.78 v59.18,50.8
SGND
  Bottom 0.61: PR18.1 PR18.2 PR18.3 PR18.4 PR18.5 PR18.6 PR18.7 PR18.8 PR18.9 PR18.10 PR18.11 PR18.12 PR18.13 PR18.14 PR18.15 PR18.16 96.52,10.16 95.25,8.89 88.9,8.89 86.36,6.35 JP4.2
SLP  (via drill 0.5)
  Top 0.305: U1.10 44.99,27.46 42.29,24.77 29.84,24.77 v29.21,24.13 | A1.9 24.47,6.31 v24.51,6.35
  Bottom 0.305: v24.51,6.35 27.94,9.78 27.94,22.86 v29.21,24.13
SPWR
  Top 0.305: U1.13 47.39,29.98 53.75,23.62 55.56,23.62 R7.2
TXD  (via drill 0.5)
  Top 0.305: U1.31 44.99,38.83 v45.72,38.1 | D2.K 30.12,15.09 30.48,14.73 SJ4.2 32,14.99 36.58,14.99 | 36.58,14.99 36.58,14.22 JP2.5 | 36.58,14.99 36.58,16.26 38.1,17.78 38.1,19.05 v45.72,26.67
  Bottom 0.305: v45.72,38.1 v45.72,26.67
VCC  (via drill 0.5, 0.6)
  Top 0.305: U1.6 44.39,35.63 v44.45,35.69 44.45,36.45 43.67,37.23 U1.4 | 55.5,32.13 L1.1 55.52,32.17 v55.52,30.48 | R5.1 R4.1 69.79,57.21 v69.85,57.15 | C9.1 25.4,34.8 26.29,35.69 26.29,36.77 R9.1 | D1.K 50.63,20.13 R1.2 v48.26,17.78 | U4.5 21.59,32.51 21.97,32.13 22.99,32.13
  Top 0.406: v31.75,17.78 SJ3.3 | v31.75,17.78 v30.48,17.78 | v31.75,17.78 v33.02,17.78 | U1.6 39.49,35.63 C1.1 | v27.94,30.48 v27.94,31.75 v27.94,33.02 25.72,33.02 C9.1 25.34,32.64 24.38,32.64 23.88,32.13 22.99,32.13
  Bottom 0.61: 68.58,52.07 PR19.1 PR19.2 PR19.3 PR19.4 PR19.5 PR19.6 PR19.7 PR19.8 PR19.9 PR19.10 PR19.11 PR19.12 PR19.13 PR19.14 PR19.15 PR19.16 68.58,8.89
  pour Bottom (isolate 0.305): -1.27,62.23 100.33,62.23 100.33,-1.27 -1.27,-1.27
XBEE_SUPPLY
  Top 0.406: A1.1 8.47,4.66 8.89,5.08 C15.1 C14.1 11.74,6.86 12.57,6.86 14.29,8.57 R14.1 15.56,8.89 22.86,8.89 25.4,11.43 25.4,16.51 30.48,21.59 SJ3.2

### Text on the board
tPlace: GND | CC BY-SA / 0315 jc | Vcc | Double-A / XBee / Sensor / Node v1 | GND | +3V- | SCL/A5 | SDA/A4 | REG1 / 5V | A3 | open / source | A2 | A1 | A0 | REG2 / input | AREF | A6 | REG1 | 13 | 12 | REG2 | XBee supply | 11 | REG1 | 10 | ASC | 8 | 3.3V | 7 | RSSI | REG2 | BLK FTDI GRN | Vcc | GND | RESET | RUN/PGM | ICSP | SGND | GND
bPlace: Double-A XBee Sensor Node / CC BY-SA 0315 jc v1 / http://goo.gl/4g7J1w | open / source